# Altium schematic sheet Top.SchDoc
size A3
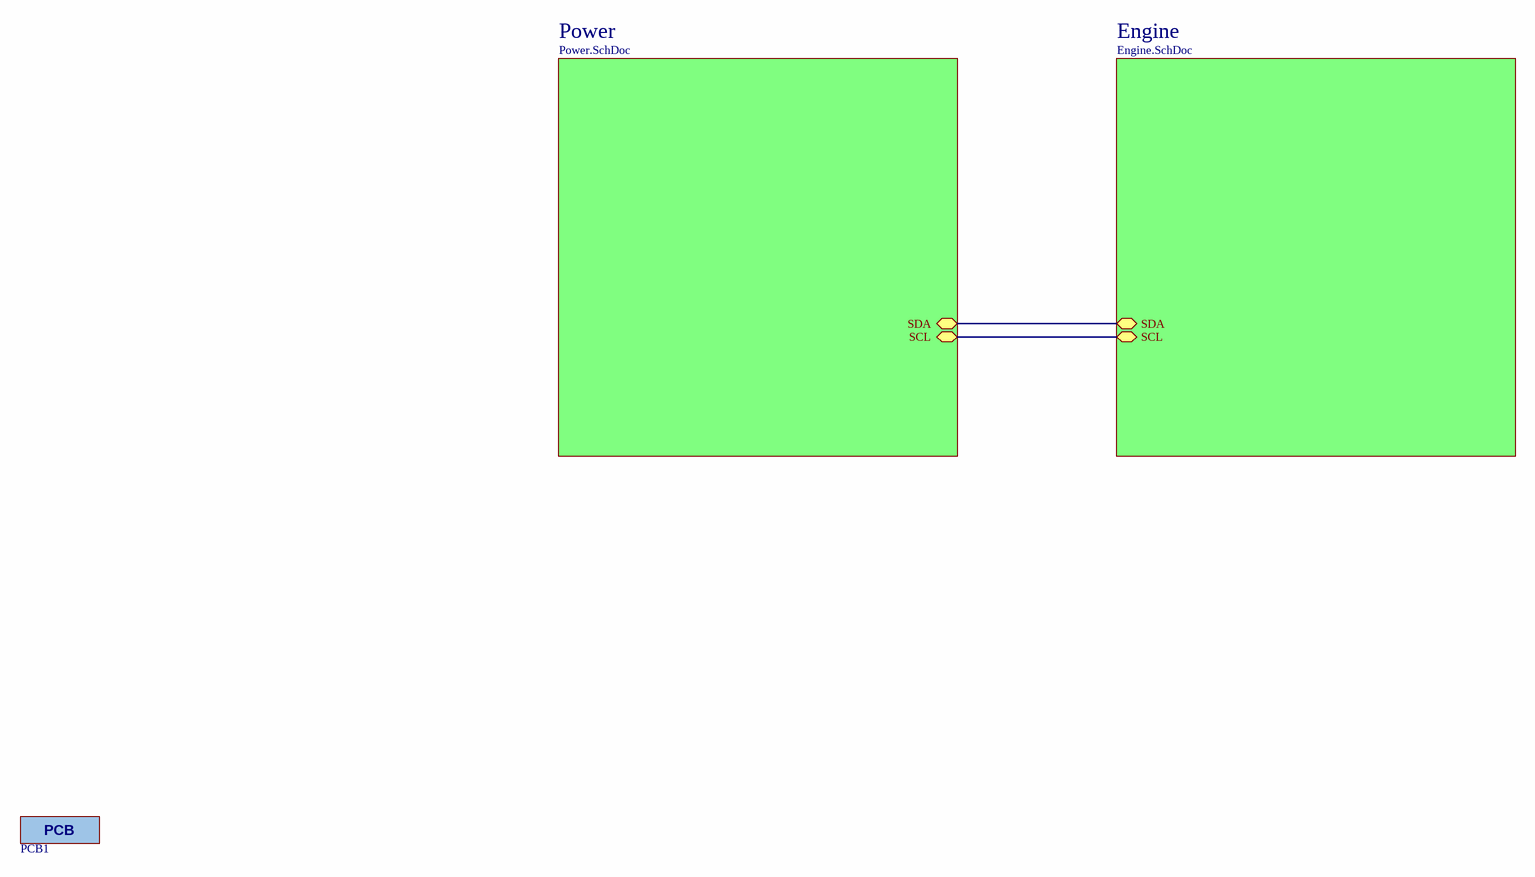
[diagram p0: Top.SchDoc]

## Parts
PCB1  PCB  [FIDUCIAL]  (value not drawn)

## Sub-sheets
Engine = Engine.SchDoc: SDA (bidir), SCL (bidir)
Power = Power.SchDoc: SDA (bidir), SCL (bidir)

## Nets
(unnamed): sheet Engine/SDA, sheet Power/SDA
(unnamed): sheet Engine/SCL, sheet Power/SCL

## Notes on the sheet
- CONFIDENTIAL
- Copyright (C) 2017 Deciduous Development AB
- Title
- Drawn By
- Date
- Time
- Checked By
- Revision
- Document Number
- Page
- of
- All rights reserved. No part of this documentation may be reproduced without the written permission of Deciduous Development AB.

## Library data of the parts
PCB1 = PCB: Printed CIrcuit Board; LatestRevisionDate: 17-Jul-2002; LatestRevisionNote: Re-released for DXP Platform.; Publisher: Altium Limited